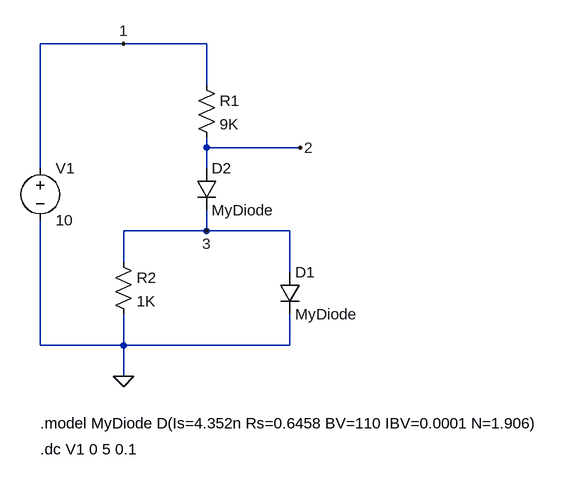
[diagram p0: schematic circuit_with_diode.asc]
circuit_with_diode.asc, the LTspice schematic file:
Version 4
SHEET 1 880 680
WIRE 160 0 32 0
WIRE 288 0 160 0
WIRE 288 64 288 0
WIRE 288 160 288 144
WIRE 432 160 288 160
WIRE 32 192 32 0
WIRE 288 192 288 160
WIRE 288 288 288 256
WIRE 288 288 160 288
WIRE 416 288 288 288
WIRE 160 336 160 288
WIRE 416 352 416 288
WIRE 32 464 32 272
WIRE 160 464 160 416
WIRE 160 464 32 464
WIRE 416 464 416 416
WIRE 416 464 160 464
WIRE 160 512 160 464
FLAG 160 512 0
FLAG 160 0 1
FLAG 432 160 2
FLAG 288 288 3
SYMBOL voltage 32 176 R0
WINDOW 123 0 0 Left 0
WINDOW 39 0 0 Left 0
SYMATTR InstName V1
SYMATTR Value 10
SYMBOL res 272 48 R0
SYMATTR InstName R1
SYMATTR Value 9K
SYMBOL res 144 320 R0
SYMATTR InstName R2
SYMATTR Value 1K
SYMBOL diode 272 192 R0
SYMATTR InstName D2
SYMATTR Value MyDiode
SYMBOL diode 400 352 R0
SYMATTR InstName D1
SYMATTR Value MyDiode
TEXT 32 584 Left 2 !.model MyDiode D(Is=4.352n Rs=0.6458 BV=110 IBV=0.0001 N=1.906)
TEXT 32 624 Left 2 !.dc V1 0 5 0.1

The netlist it stands for:
* circuit_with_diode.asc
V1 1 0 10
R1 1 2 9K
R2 3 0 1K
D2 2 3 MyDiode
D1 3 0 MyDiode
.model D D
.lib standard.dio
.model MyDiode D(Is=4.352n Rs=0.6458 BV=110 IBV=0.0001 N=1.906)
.dc V1 0 5 0.1
.backanno
.end

* Results of the author's LTspice run, read from the files saved beside the schematic
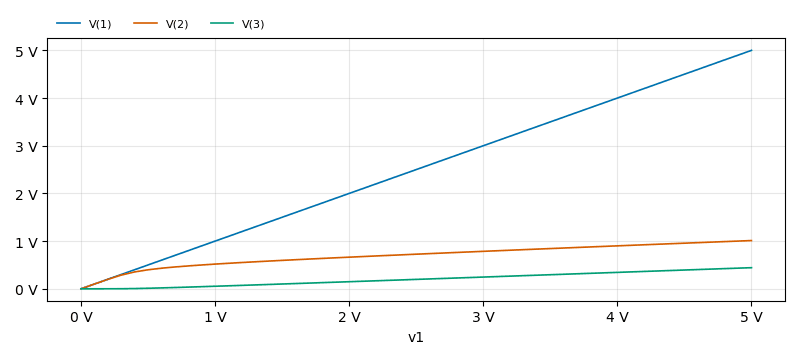
[diagram p1: DC transfer characteristic of circuit_with_diode.asc, plotted from the saved traces]
* DC transfer characteristic, 1 run:
*   V(1): 0 V at v1=0 V, 5 V at v1=5 V, min 0 V, max 5 V
*   V(2): 0 V at v1=0 V, 1.012 V at v1=5 V, min 0 V, max 1.012 V
*   V(3): 0 V at v1=0 V, 442.9 mV at v1=5 V, min 0 V, max 442.9 mV